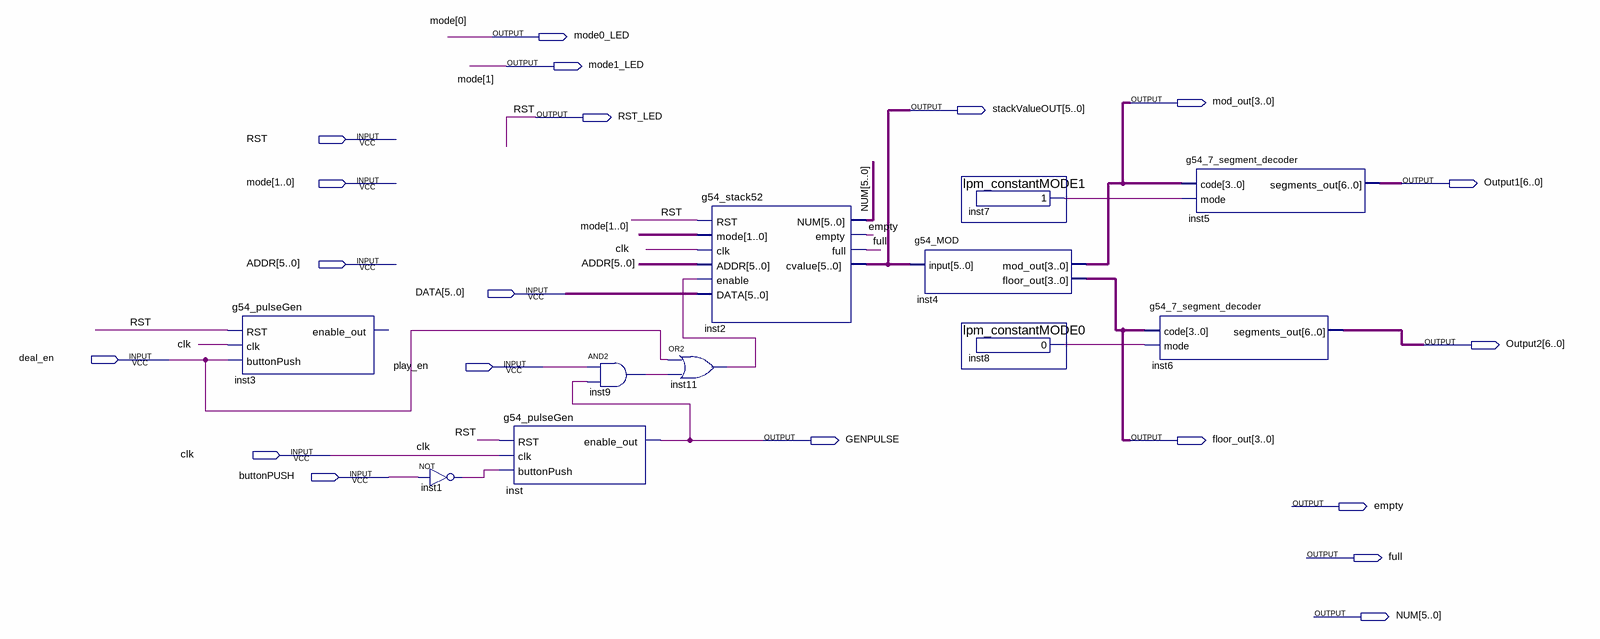
[diagram p0: schematic sheet]
// Quartus schematic g54_stackTestBed.bdf as structural Verilog: 11 symbols, 20 pins
module g54_stackTestBed (
  input  RST,
  input  [1:0] mode,
  input  [5:0] ADDR,
  input  [5:0] DATA,
  input  deal_en,
  input  play_en,
  input  clk,
  input  buttonPUSH,
  output mode0_LED,
  output mode1_LED,
  output [3:0] mod_out,
  output [5:0] stackValueOUT,
  output RST_LED,
  output [6:0] Output1,
  output [6:0] Output2,
  output GENPULSE,
  output [3:0] floor_out,
  output empty,
  output full,
  output [5:0] NUM
);

  wire inst1_out, inst7_result, inst8_result, inst9_out, inst11_out;

  g54_pulseGen inst3 (.RST(RST), .clk(clk), .buttonPush(deal_en));  // open: enable_out
  not inst1 (inst1_out, buttonPUSH);
  g54_pulseGen inst (.RST(RST), .clk(clk), .buttonPush(inst1_out), .enable_out(GENPULSE));
  and inst9 (inst9_out, play_en, GENPULSE);
  or inst11 (inst11_out, deal_en, inst9_out);
  g54_stack52 inst2 (
    .RST(RST), .mode(mode), .clk(clk), .ADDR(ADDR), .enable(inst11_out), .DATA(DATA), .NUM(NUM),
    .empty(empty), .full(full), .cvalue(stackValueOUT));
  g54_MOD inst4 (.\input (stackValueOUT), .mod_out(mod_out), .floor_out(floor_out));
  lpm_constantMODE1 inst7 (.result(inst7_result));
  lpm_constantMODE0 inst8 (.result(inst8_result));
  g54_7_segment_decoder inst6 (.code(floor_out), .mode(inst8_result), .segments_out(Output2));
  g54_7_segment_decoder inst5 (.code(mod_out), .mode(inst7_result), .segments_out(Output1));

  assign mode0_LED = mode[0];
  assign mode1_LED = mode[1];
  assign RST_LED = RST;
endmodule
